# Altium schematic sheet Encoder.SchDoc
size Tabloid; Organization: Altium Limited; Address1: L3, 12a Rodborough Rd; Address2: Frenchs Forest; Address3: NSW; Address4: Australia 2086
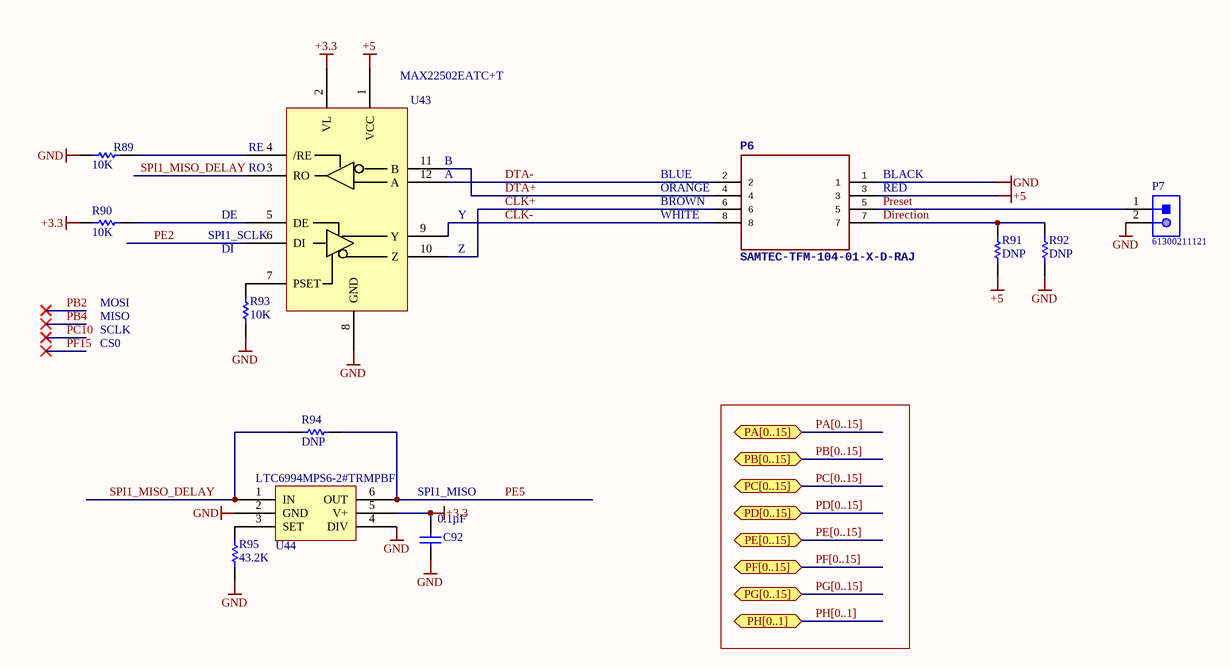
[diagram p0: Encoder.SchDoc]

## Parts
C92  Capacitance: 0.1µF  [CAPC0805(2012)145_N]  (hidden comment: CAP CER 0.1UF 25V X7R 0805)
P6  SAMTEC-TFM-104-01-X-D-RAJ  [SAMTEC-TFM-104-01-X-D-RA]
P7  61300211121  [61300211121]
R89  10K  [RESC0805(2012)_L]
R90  10K  [RESC0805(2012)_L]
R91  DNP  [RESC0805(2012)_L]
R92  DNP  [RESC0805(2012)_L]
R93  10K  [RESC0805(2012)_L]
R94  DNP  [RESC0805(2012)_L]
R95  43.2K  [RESC0805(2012)_L]
U43  MAX22502EATC+T  [MAX22502EATC+T]
U44  LTC6994MPS6-2#TRMPBF  [LTC6994MPS6-2#TRMPBF]

## Ports
PA[0..15] (bidir), PB[0..15] (bidir), PC[0..15] (bidir), PD[0..15] (bidir), PE[0..15] (bidir), PF[0..15] (bidir), PG[0..15] (bidir), PH[0..1] (bidir)

## Nets
+3.3: C92.1 R90.2 U43.2(VL) U44.5(V+)
+5: P6.3 R91.1 U43.1(VCC)
GND: C92.2 P6.1 P7.2 R89.2 R92.1 R93.2 R95.2 U43.8(GND) U44.2(GND) U44.4(DIV)
CLK+: P6.6 U43.10(Z)
CLK-: P6.8 U43.9(Y)
Direction: P6.7 R91.2 R92.2
DTA+: P6.4 U43.11(B)
DTA-: P6.2 U43.12(A)
PE2: U43.6(DI)
PE5: R94.2 U44.6(OUT)
Preset: P6.5 P7.1
SPI1_MISO_DELAY: R94.1 U43.3(RO) U44.1(IN)
NetR89_1: R89.1 U43.4(/RE)
NetR90_1: R90.1 U43.5(DE)
NetR93_1: R93.1 U43.7(PSET)
NetR95_1: R95.1 U44.3(SET)

## Buses and harness runs
bus PA[0..15] = port PA[0..15]
bus PB[0..15] = port PB[0..15]
bus PC[0..15] = port PC[0..15]
bus PD[0..15] = port PD[0..15]
bus PE[0..15] = port PE[0..15]
bus PF[0..15] = port PF[0..15]
bus PG[0..15] = port PG[0..15]
bus PH[0..1] = port PH[0..1]

## Notes on the sheet
- (near U43) RO
- (near U43) RE
- (near U43) B
- (near U43) A
- BLUE
- (near P6) BLACK
- (near U43) SPI1_SCLK
- DE
- (near U43) Y
- (near P6) BROWN
- (near P6) WHITE
- (near P6) ORANGE
- (near P6) RED
- MOSI
- DI
- (near U43) Z
- MISO
- SCLK
- CS0
- (near C92) SPI1_MISO
- Title
- Size:
- Date:
- Tabloid
- Number:
- Time:
- Revision:
- Sheet
- of
- File:

## Library data of the parts
C92 = CMP-1036-04795-1: Manufacturer: Murata Electronics North America; Manufacturer Part Number: GRM21BR71E104KA01L; Tolerance: ±10%; Supplier 1: Digi-Key; Supplier Part Number 1: 490-1673-6-ND; RoHS: RoHS Compliant; Category: Capacitors; Stock 1: 891652; Pricing 1: 1=0.2, 10=0.145, 100=0.0683, 500=0.04788, 1000=0.03964 (USD); Packaging: Digi-Reel®; Part Status: Active; Voltage - Rated: 25V; Temperature Coefficient: X7R; Operating Temperature: -55°C ~ 125°C; Features: -; Ratings: -; Applications: General Purpose; Mounting Type: Surface Mount, MLCC; Package / Case: 0805 (2012 Metric); Size / Dimension: 0.079" L x 0.049" W (2.00mm x 1.25mm); Height - Seated (Max): -; Thickness (Max): 0.053" (1.35mm); Lead Spacing: -; Lead Style: -; ComponentLink1URL: http://www.murata.com/~/media/webrenewal/support/library/catalog/products/capacitor/mlcc/c02e.ashx; ComponentLink1Description: http://www.murata.com/~/media/webrenewal/support/library/catalog/products/capacitor/mlcc/c02e.ashx
P7 = CMP-1502-01060-1: THT Vertical Pin Header WR-PHD, Pitch 2.54 mm, Single Row, 2 pins; Manufacturer: Wurth Elektronik; Rated Current: 3A; Gender: Male; Withstanding Voltage: 500VAC; Working Voltage: 250VAC; Pitch: 2.54mm; Contact Resistance: 20mOhm; Pin Number: 2; Mounting Technology: THT; Orientation: Vertical; Operating Temperature: -40to105degC; Packaging: Bag; Publisher: WurthElektronik; Datasheet URL: https://katalog.we-online.de/em/datasheet/6130xx11121.pdf; Manufacturer URL: http://www.we-online.de; Row Number: Single; Package Reference: 61300211121; Part Number: 61300211121
R89 R90 R93 = CMP-1013-00215-1: RES SMD 10K OHM 1% 1/8W 0805; Manufacturer: Vishay Dale; Manufacturer Part Number: CRCW080510K0FKEA; Power (Watts): 0.125W, 1/8W; Temperature Coefficient: ±100ppm/°C; Supplier 1: Digi-Key; Supplier Part Number 1: 541-10.0KCCT-ND; RoHS: RoHS Compliant; Category: Resistors; Stock 1: 1104982; Pricing 1: 1=0.1, 10=0.055, 100=0.0223, 1000=0.01003, 2500=0.0087 (USD); Packaging: Cut Tape (CT); Part Status: Active; Tolerance: ±1%; Composition: Thick Film; Features: Automotive AEC-Q200; Operating Temperature: -55°C ~ 155°C; Package / Case: 0805 (2012 Metric); Supplier Device Package: 0805; Size / Dimension: 0.079" L x 0.049" W (2.00mm x 1.25mm); Height - Seated (Max): 0.020" (0.50mm); Failure Rate: -; ComponentLink1URL: http://www.vishay.com/docs/20035/dcrcwe3.pdf; ComponentLink1Description: http://www.vishay.com/docs/20035/dcrcwe3.pdf
R91 R92 R94 = CMP-1013-00215-1: RES SMD 0 OHM 5% 1/8W 0805
R95 = CMP-1013-00215-1: RES SMD 43.2K OHM 1% 1/8W 0805; Manufacturer: Vishay Dale; Manufacturer Part Number: CRCW080543K2FKEA; Power (Watts): 0.125W, 1/8W; Temperature Coefficient: ±100ppm/°C; Supplier 1: Digi-Key; Supplier Part Number 1: 541-43.2KCCT-ND; RoHS: RoHS Compliant; Category: Resistors; Stock 1: 68577; Pricing 1: 1=0.1, 10=0.055, 100=0.0223, 1000=0.01003, 2500=0.0087 (USD); Packaging: Cut Tape (CT); Part Status: Active; Tolerance: ±1%; Composition: Thick Film; Features: Automotive AEC-Q200; Operating Temperature: -55°C ~ 155°C; Package / Case: 0805 (2012 Metric); Supplier Device Package: 0805; Size / Dimension: 0.079" L x 0.049" W (2.00mm x 1.25mm); Height - Seated (Max): 0.020" (0.50mm); Failure Rate: -; ComponentLink1URL: http://www.vishay.com/docs/20035/dcrcwe3.pdf; ComponentLink1Description: http://www.vishay.com/docs/20035/dcrcwe3.pdf
U44 = LTC6994MPS6-2#TRMPBF: Manufacturer: Linear Technology/Analog Devices; Manufacturer Part Number: LTC6994CS6-2#TRMPBF; Function: Programmable; Available Total Delays: 1µs ~ 33.6s; Voltage - Supply: 2.25 V ~ 5.5 V; Supplier 1: Digi-Key; Supplier Part Number 1: LTC6994CS6-2#TRMPBFCT-ND; RoHS: RoHS Compliant; Category: Integrated Circuits (ICs); Stock 1: 1401; Pricing 1: 1=3.42, 25=3.0496, 100=1.9217, 250=1.76156 (USD); Packaging: Cut Tape (CT); Part Status: Active; Delay to 1st Tap: -; Operating Temperature: 0°C ~ 70°C; Mounting Type: Surface Mount; Package / Case: SOT-23-6 Thin, TSOT-23-6; Supplier Device Package: TSOT-23-6; Base Part Number: LTC6994; ComponentLink1URL: http://www.linear.com/docs/29725; ComponentLink1Description: http://www.linear.com/docs/29725